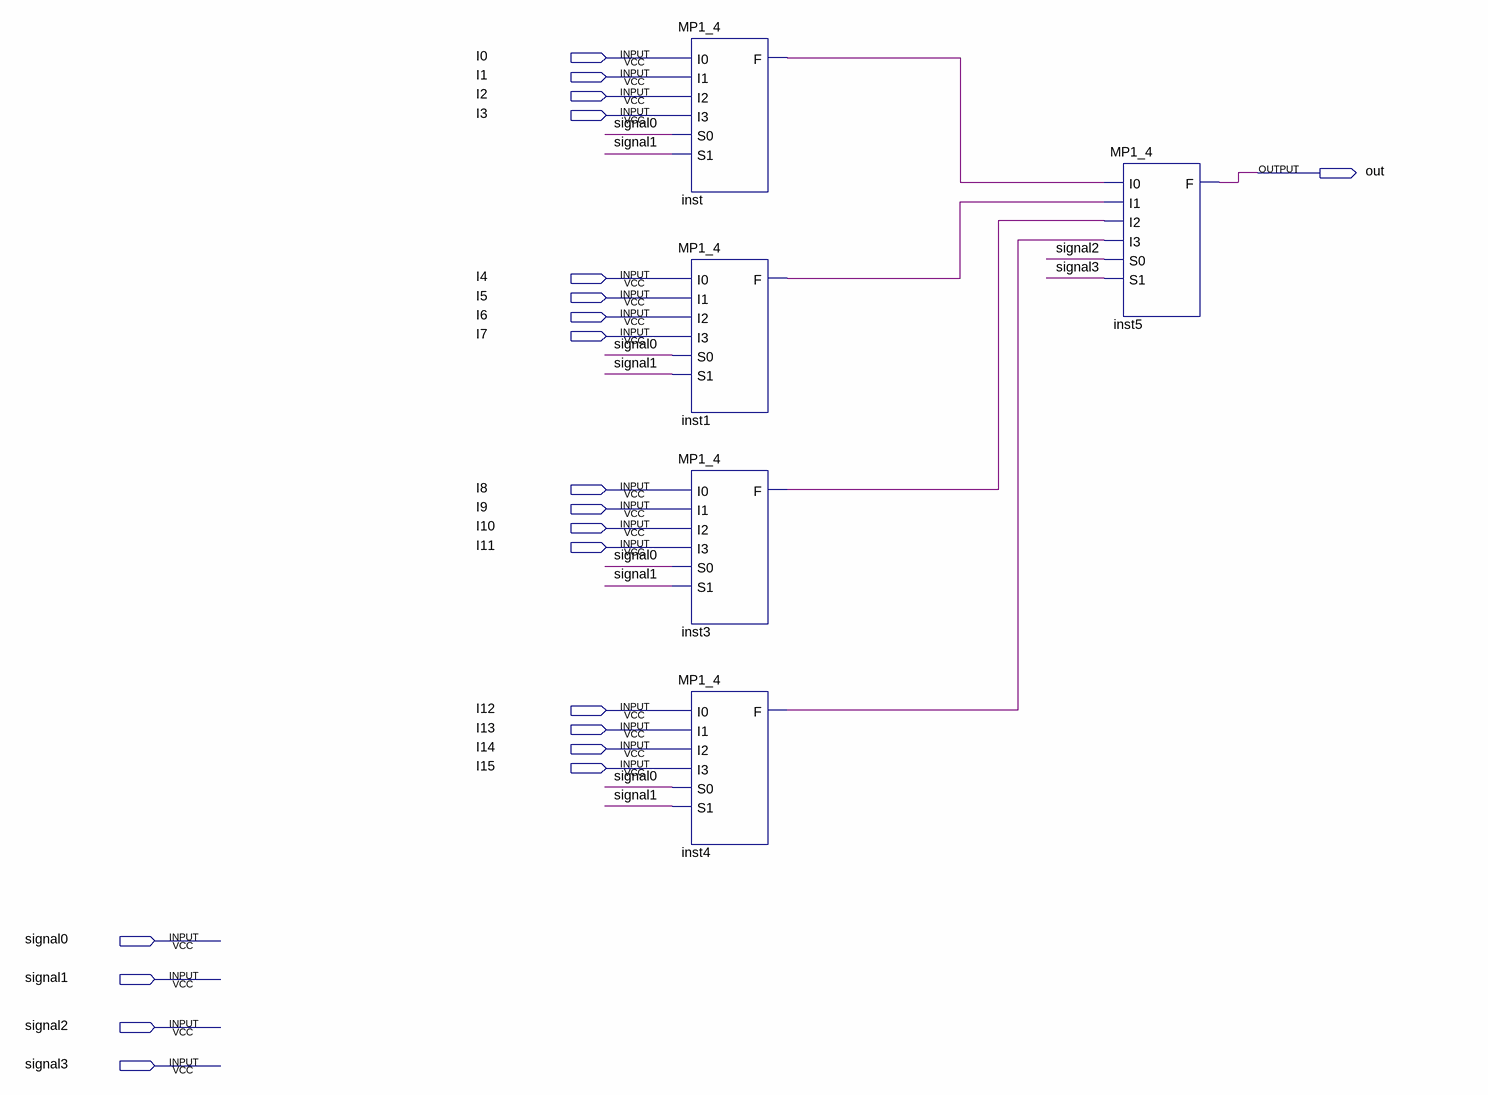
[diagram p0: schematic sheet]
// Quartus schematic mp1_16.bdf as structural Verilog: 5 symbols, 21 pins
module mp1_16 (
  input  I0,
  input  I1,
  input  I2,
  input  I3,
  input  I4,
  input  I5,
  input  I6,
  input  I7,
  input  I8,
  input  I9,
  input  I10,
  input  I11,
  input  I12,
  input  I13,
  input  I14,
  input  I15,
  input  signal0,
  input  signal1,
  input  signal2,
  input  signal3,
  output out
);

  wire inst1_f, inst3_f, inst4_f, inst_f;

  MP1_4 inst (.I0(I0), .I1(I1), .I2(I2), .I3(I3), .S0(signal0), .S1(signal1), .F(inst_f));
  MP1_4 inst1 (.I0(I4), .I1(I5), .I2(I6), .I3(I7), .S0(signal0), .S1(signal1), .F(inst1_f));
  MP1_4 inst3 (.I0(I8), .I1(I9), .I2(I10), .I3(I11), .S0(signal0), .S1(signal1), .F(inst3_f));
  MP1_4 inst4 (.I0(I12), .I1(I13), .I2(I14), .I3(I15), .S0(signal0), .S1(signal1), .F(inst4_f));
  MP1_4 inst5 (.I0(inst_f), .I1(inst1_f), .I2(inst3_f), .I3(inst4_f), .S0(signal2), .S1(signal3), .F(out));
endmodule
